# Altium schematic sheet Micro SD.SchDoc
size A4; SheetNumber: 4; SheetTotal: 12
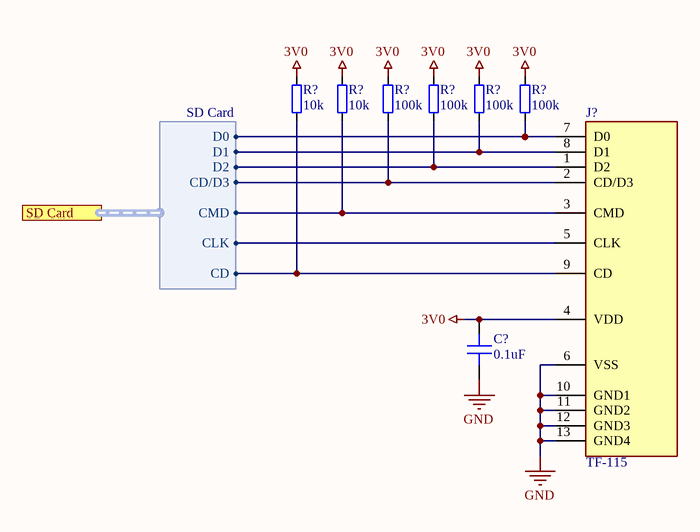
[diagram p0: Micro SD.SchDoc]

## Parts
(Parts that share a designator on the sheet are numbered #1, #2 ... from top to bottom, then left to right.)
C?  0.1uF  [CAPC1005X06N]
J?  TF-115  [TF-115]
R?#1  10k  [RESC1005X35N]
R?#2  10k  [RESC1005X35N]
R?#3  100k  [RESC1005X35N]
R?#4  100k  [RESC1005X35N]
R?#5  100k  [RESC1005X35N]
R?#6  100k  [RESC1005X35N]

## Ports
SD Card (harness SD Card)

## Harnesses
SD Card: D0, D1, D2, CD/D3, CMD, CLK, CD

## Nets
3V0: C?.2 J?.4(VDD) R?#1.1 R?#2.2 R?#3.2 R?#4.2 R?#5.2 R?#6.2
GND: C?.1 J?.6(VSS) J?.10(GND1) J?.11(GND2) J?.12(GND3) J?.13(GND4)
NetJ?_1: J?.1(D2) R?#4.1 ; port SD Card.D2
NetJ?_2: J?.2(CD/D3) R?#3.1 ; port SD Card.CD/D3
NetJ?_3: J?.3(CMD) R?#2.1 ; port SD Card.CMD
NetJ?_5: J?.5(CLK) ; port SD Card.CLK
NetJ?_7: J?.7(D0) R?#6.1 ; port SD Card.D0
NetJ?_8: J?.8(D1) R?#5.1 ; port SD Card.D1
NetJ?_9: J?.9(CD) R?#1.2 ; port SD Card.CD

## Library data of the parts
C? = 0402B104K500CT: Manufacturer: Walsin Tech Corp; Voltage: 50V; Tolerance: 10%; Dielectric: X7R; Min Temperature: -55; Max Temperature: 125; Part Number: 0402B104K500CT; ComponentLink1URL: https://datasheet.lcsc.com/lcsc/1810191621_Walsin-Tech-Corp-0402B104K500CT_C152814.pdf; ComponentLink1Description: Datasheet; Package: 0402; Part Status: Active; Capacitance: 0.1uF
J? = TF-115: Micro-SD card holder; MANUFACTURER: XUNPU; Part Number: TF-115; COMPONENTLINK1URL: https://datasheet.lcsc.com/lcsc/2109061830_XUNPU-TF-115_C266620.pdf; COMPONENTLINK1DESCRIPTION: Datasheet; PACKAGE: SMD; Part Status: Active
R?#1 R?#2 = WR04X1002FTL: Resistor; Manufacturer: Walsin Tech Corp; Tolerance: 1%; Power: 1/16 W; Temperature Coefficient: 100ppm; Min Temperature: -55°C; Max Temperature: 155°C; Part Number: WR04X1002FTL; ComponentLink1URL: https://datasheet.lcsc.com/lcsc/2304140030_Walsin-Tech-Corp-WR04X1002FTL_C163810.pdf; ComponentLink1Description: Datasheet; Package: 0402; Part Status: Active; Resistance: 10k
R?#3-R?#6 = WR04X1003FTL: Resistor; Manufacturer: Walsin Tech Corp; Tolerance: 1%; Power: 1/16 W; Temperature Coefficient: 100ppm; Min Temperature: -55°C; Max Temperature: 155°C; Part Number: WR04X1003FTL; ComponentLink1URL: https://datasheet.lcsc.com/lcsc/2304140030_Walsin-Tech-Corp-WR04X1003FTL_C163806.pdf; ComponentLink1Description: Datasheet; Package: 0402; Part Status: Active; Resistance: 100k